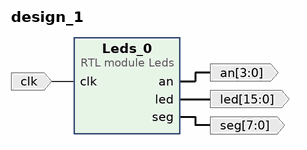
[diagram p0: block diagram of the top level]
# Vivado block design design_1, xc7a35tcpg236-1, Vivado 2021.1
create_bd_design design_1

create_bd_port -dir I -type clk clk
set_property -dict {CONFIG.FREQ_HZ 100000000} [get_bd_ports clk]
create_bd_port -dir O -from 7 -to 0 seg
create_bd_port -dir O -from 3 -to 0 an
create_bd_port -dir O -from 15 -to 0 led

create_bd_cell -type module -reference Leds Leds_0

# ---- connections ----

connect_bd_net [get_bd_pins Leds_0/an] [get_bd_ports an]
connect_bd_net [get_bd_pins Leds_0/led] [get_bd_ports led]
connect_bd_net [get_bd_pins Leds_0/seg] [get_bd_ports seg]
connect_bd_net [get_bd_ports clk] [get_bd_pins Leds_0/clk]

validate_bd_design
save_bd_design
